# EAGLE design driver_board_v7 (EAGLE 6.5.0)
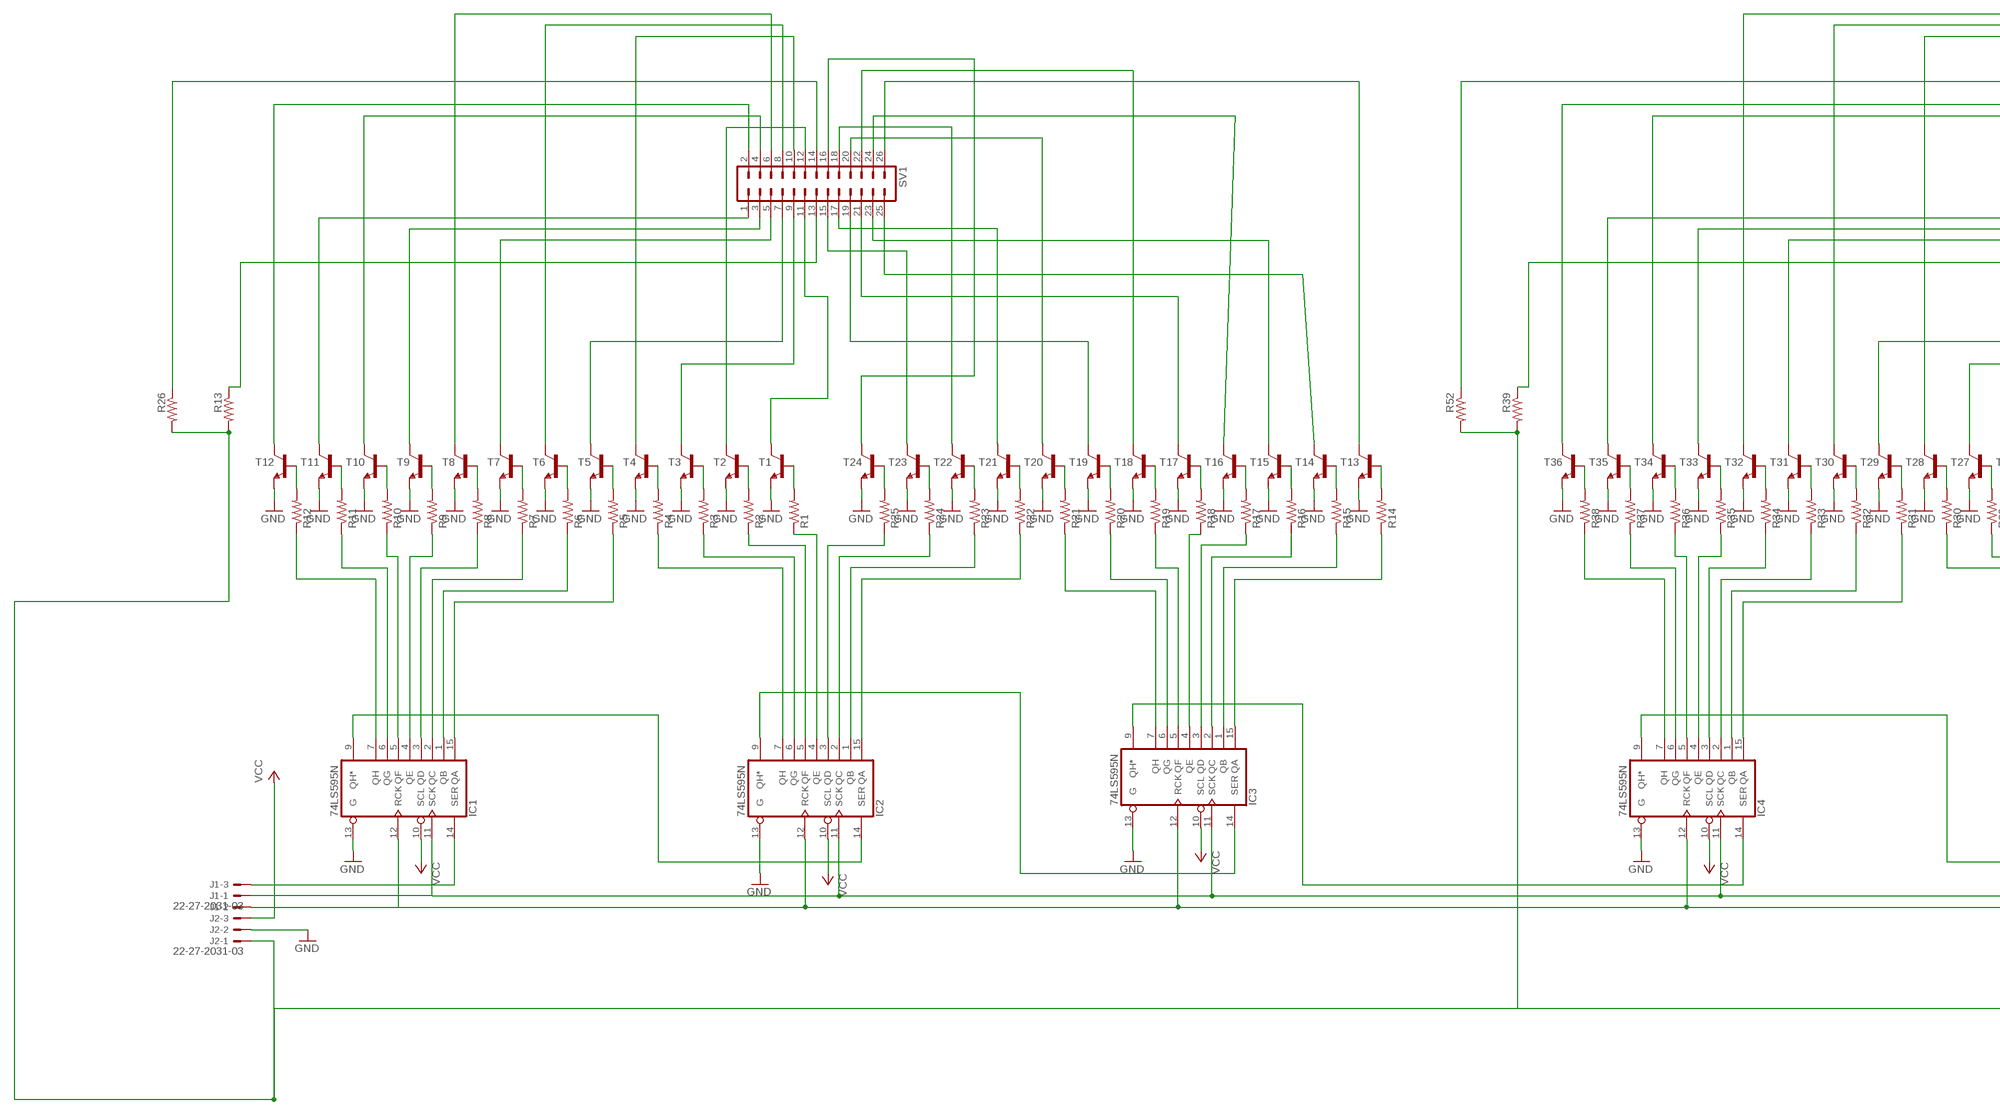
[diagram p0: schematic, sheet 1, part 1 of 2]
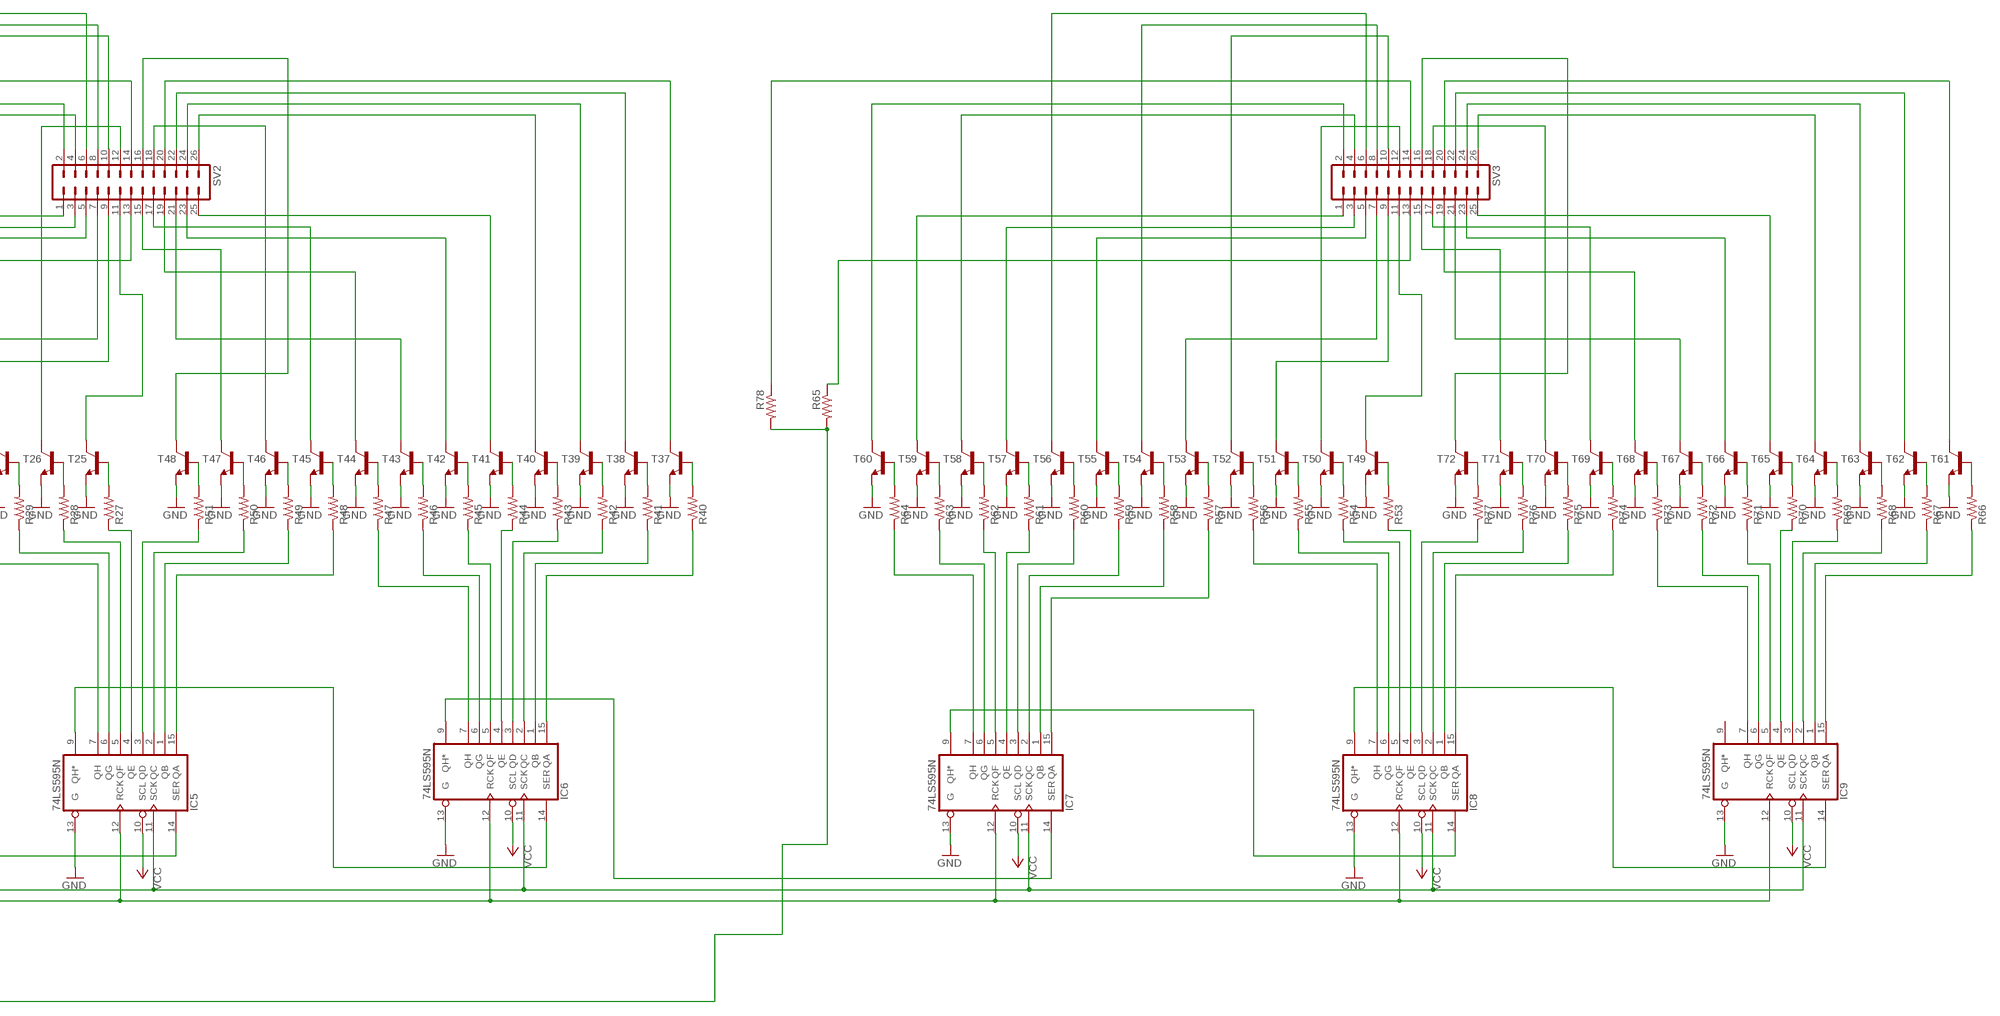
[diagram p1: schematic, sheet 1, part 2 of 2]

## Parts
IC1  74LS595N  [DIL16]
IC2  74LS595N  [DIL16]
IC3  74LS595N  [DIL16]
IC4  74LS595N  [DIL16]
IC5  74LS595N  [DIL16]
IC6  74LS595N  [DIL16]
IC7  74LS595N  [DIL16]
IC8  74LS595N  [DIL16]
IC9  74LS595N  [DIL16]
J1  22-27-2031-03  [6410-03]
J2  22-27-2031-03  [6410-03]
R1  R-US_0204/7  [0204/7]
R2  R-US_0204/7  [0204/7]
R3  R-US_0204/7  [0204/7]
R4  R-US_0204/7  [0204/7]
R5  R-US_0204/7  [0204/7]
R6  R-US_0204/7  [0204/7]
R7  R-US_0204/7  [0204/7]
R8  R-US_0204/7  [0204/7]
R9  R-US_0204/7  [0204/7]
R10  R-US_0204/7  [0204/7]
R11  R-US_0204/7  [0204/7]
R12  R-US_0204/7  [0204/7]
R13  R-US_0204/7  [0204/7]
R14  R-US_0204/7  [0204/7]
R15  R-US_0204/7  [0204/7]
R16  R-US_0204/7  [0204/7]
R17  R-US_0204/7  [0204/7]
R18  R-US_0204/7  [0204/7]
R19  R-US_0204/7  [0204/7]
R20  R-US_0204/7  [0204/7]
R21  R-US_0204/7  [0204/7]
R22  R-US_0204/7  [0204/7]
R23  R-US_0204/7  [0204/7]
R24  R-US_0204/7  [0204/7]
R25  R-US_0204/7  [0204/7]
R26  R-US_0204/7  [0204/7]
R27  R-US_0204/7  [0204/7]
R28  R-US_0204/7  [0204/7]
R29  R-US_0204/7  [0204/7]
R30  R-US_0204/7  [0204/7]
R31  R-US_0204/7  [0204/7]
R32  R-US_0204/7  [0204/7]
R33  R-US_0204/7  [0204/7]
R34  R-US_0204/7  [0204/7]
R35  R-US_0204/7  [0204/7]
R36  R-US_0204/7  [0204/7]
R37  R-US_0204/7  [0204/7]
R38  R-US_0204/7  [0204/7]
R39  R-US_0204/7  [0204/7]
R40  R-US_0204/7  [0204/7]
R41  R-US_0204/7  [0204/7]
R42  R-US_0204/7  [0204/7]
R43  R-US_0204/7  [0204/7]
R44  R-US_0204/7  [0204/7]
R45  R-US_0204/7  [0204/7]
R46  R-US_0204/7  [0204/7]
R47  R-US_0204/7  [0204/7]
R48  R-US_0204/7  [0204/7]
R49  R-US_0204/7  [0204/7]
R50  R-US_0204/7  [0204/7]
R51  R-US_0204/7  [0204/7]
R52  R-US_0204/7  [0204/7]
R53  R-US_0204/7  [0204/7]
R54  R-US_0204/7  [0204/7]
R55  R-US_0204/7  [0204/7]
R56  R-US_0204/7  [0204/7]
R57  R-US_0204/7  [0204/7]
R58  R-US_0204/7  [0204/7]
R59  R-US_0204/7  [0204/7]
R60  R-US_0204/7  [0204/7]
R61  R-US_0204/7  [0204/7]
R62  R-US_0204/7  [0204/7]
R63  R-US_0204/7  [0204/7]
R64  R-US_0204/7  [0204/7]
R65  R-US_0204/7  [0204/7]
R66  R-US_0204/7  [0204/7]
R67  R-US_0204/7  [0204/7]
R68  R-US_0204/7  [0204/7]
R69  R-US_0204/7  [0204/7]
R70  R-US_0204/7  [0204/7]
R71  R-US_0204/7  [0204/7]
R72  R-US_0204/7  [0204/7]
R73  R-US_0204/7  [0204/7]
R74  R-US_0204/7  [0204/7]
R75  R-US_0204/7  [0204/7]
R76  R-US_0204/7  [0204/7]
R77  R-US_0204/7  [0204/7]
R78  R-US_0204/7  [0204/7]
SV1  MA13-2  [MA13-2]
SV2  MA13-2  [MA13-2]
SV3  MA13-2  [MA13-2]
T1  29-NPN-TO92-EBC  [TO92-EBC]
T2  29-NPN-TO92-EBC  [TO92-EBC]
T3  29-NPN-TO92-EBC  [TO92-EBC]
T4  29-NPN-TO92-EBC  [TO92-EBC]
T5  29-NPN-TO92-EBC  [TO92-EBC]
T6  29-NPN-TO92-EBC  [TO92-EBC]
T7  29-NPN-TO92-EBC  [TO92-EBC]
T8  29-NPN-TO92-EBC  [TO92-EBC]
T9  29-NPN-TO92-EBC  [TO92-EBC]
T10  29-NPN-TO92-EBC  [TO92-EBC]
T11  29-NPN-TO92-EBC  [TO92-EBC]
T12  29-NPN-TO92-EBC  [TO92-EBC]
T13  29-NPN-TO92-EBC  [TO92-EBC]
T14  29-NPN-TO92-EBC  [TO92-EBC]
T15  29-NPN-TO92-EBC  [TO92-EBC]
T16  29-NPN-TO92-EBC  [TO92-EBC]
T17  29-NPN-TO92-EBC  [TO92-EBC]
T18  29-NPN-TO92-EBC  [TO92-EBC]
T19  29-NPN-TO92-EBC  [TO92-EBC]
T20  29-NPN-TO92-EBC  [TO92-EBC]
T21  29-NPN-TO92-EBC  [TO92-EBC]
T22  29-NPN-TO92-EBC  [TO92-EBC]
T23  29-NPN-TO92-EBC  [TO92-EBC]
T24  29-NPN-TO92-EBC  [TO92-EBC]
T25  29-NPN-TO92-EBC  [TO92-EBC]
T26  29-NPN-TO92-EBC  [TO92-EBC]
T27  29-NPN-TO92-EBC  [TO92-EBC]
T28  29-NPN-TO92-EBC  [TO92-EBC]
T29  29-NPN-TO92-EBC  [TO92-EBC]
T30  29-NPN-TO92-EBC  [TO92-EBC]
T31  29-NPN-TO92-EBC  [TO92-EBC]
T32  29-NPN-TO92-EBC  [TO92-EBC]
T33  29-NPN-TO92-EBC  [TO92-EBC]
T34  29-NPN-TO92-EBC  [TO92-EBC]
T35  29-NPN-TO92-EBC  [TO92-EBC]
T36  29-NPN-TO92-EBC  [TO92-EBC]
T37  29-NPN-TO92-EBC  [TO92-EBC]
T38  29-NPN-TO92-EBC  [TO92-EBC]
T39  29-NPN-TO92-EBC  [TO92-EBC]
T40  29-NPN-TO92-EBC  [TO92-EBC]
T41  29-NPN-TO92-EBC  [TO92-EBC]
T42  29-NPN-TO92-EBC  [TO92-EBC]
T43  29-NPN-TO92-EBC  [TO92-EBC]
T44  29-NPN-TO92-EBC  [TO92-EBC]
T45  29-NPN-TO92-EBC  [TO92-EBC]
T46  29-NPN-TO92-EBC  [TO92-EBC]
T47  29-NPN-TO92-EBC  [TO92-EBC]
T48  29-NPN-TO92-EBC  [TO92-EBC]
T49  29-NPN-TO92-EBC  [TO92-EBC]
T50  29-NPN-TO92-EBC  [TO92-EBC]
T51  29-NPN-TO92-EBC  [TO92-EBC]
T52  29-NPN-TO92-EBC  [TO92-EBC]
T53  29-NPN-TO92-EBC  [TO92-EBC]
T54  29-NPN-TO92-EBC  [TO92-EBC]
T55  29-NPN-TO92-EBC  [TO92-EBC]
T56  29-NPN-TO92-EBC  [TO92-EBC]
T57  29-NPN-TO92-EBC  [TO92-EBC]
T58  29-NPN-TO92-EBC  [TO92-EBC]
T59  29-NPN-TO92-EBC  [TO92-EBC]
T60  29-NPN-TO92-EBC  [TO92-EBC]
T61  29-NPN-TO92-EBC  [TO92-EBC]
T62  29-NPN-TO92-EBC  [TO92-EBC]
T63  29-NPN-TO92-EBC  [TO92-EBC]
T64  29-NPN-TO92-EBC  [TO92-EBC]
T65  29-NPN-TO92-EBC  [TO92-EBC]
T66  29-NPN-TO92-EBC  [TO92-EBC]
T67  29-NPN-TO92-EBC  [TO92-EBC]
T68  29-NPN-TO92-EBC  [TO92-EBC]
T69  29-NPN-TO92-EBC  [TO92-EBC]
T70  29-NPN-TO92-EBC  [TO92-EBC]
T71  29-NPN-TO92-EBC  [TO92-EBC]
T72  29-NPN-TO92-EBC  [TO92-EBC]

## Nets
GND: IC1.13(G) IC2.13(G) IC3.13(G) IC4.13(G) IC5.13(G) IC6.13(G) IC7.13(G) IC8.13(G) IC9.13(G) J2.2 T1.E T2.E T3.E T4.E T5.E T6.E T7.E T8.E T9.E T10.E T11.E T12.E T13.E T14.E T15.E T16.E T17.E T18.E T19.E T20.E T21.E T22.E T23.E T24.E T25.E T26.E T27.E T28.E T29.E T30.E T31.E T32.E T33.E T34.E T35.E T36.E T37.E T38.E T39.E T40.E T41.E T42.E T43.E T44.E T45.E T46.E T47.E T48.E T49.E T50.E T51.E T52.E T53.E T54.E T55.E T56.E T57.E T58.E T59.E T60.E T61.E T62.E T63.E T64.E T65.E T66.E T67.E T68.E T69.E T70.E T71.E T72.E
HV: J2.1 R13.2 R26.2 R39.2 R52.2 R65.2 R78.2
N$1: R12.2 T12.B
N$2: R11.2 T11.B
N$3: R10.2 T10.B
N$4: R9.2 T9.B
N$5: R8.2 T8.B
N$6: R7.2 T7.B
N$7: R6.2 T6.B
N$8: R5.2 T5.B
N$9: R4.2 T4.B
N$10: R3.2 T3.B
N$11: R2.2 T2.B
N$12: R1.2 T1.B
N$13: SV1.11 T1.C
N$14: R38.2 T36.B
N$15: R37.2 T35.B
N$16: SV1.3 T9.C
N$17: SV1.6 T8.C
N$18: SV1.5 T7.C
N$19: R36.2 T34.B
N$20: SV1.12 T2.C
N$21: SV1.9 T3.C
N$22: SV1.8 T6.C
N$23: SV1.7 T5.C
N$24: SV1.10 T4.C
N$25: R26.1 SV1.14
N$26: R25.2 T24.B
N$27: R24.2 T23.B
N$28: R23.2 T22.B
N$29: R22.2 T21.B
N$30: R21.2 T20.B
N$31: R20.2 T19.B
N$32: R19.2 T18.B
N$33: R18.2 T17.B
N$34: R17.2 T16.B
N$35: R16.2 T15.B
N$36: R15.2 T14.B
N$37: R14.2 T13.B
N$38: SV1.16 T24.C
N$39: SV1.15 T23.C
N$40: SV1.18 T22.C
N$41: SV1.17 T21.C
N$42: SV1.20 T20.C
N$43: SV1.19 T19.C
N$44: SV1.26 T13.C
N$45: SV1.25 T14.C
N$46: SV1.23 T15.C
N$47: SV1.22 T18.C
N$48: SV1.21 T17.C
N$49: SV1.24 T16.C
N$51: R13.1 SV1.13
N$52: IC1.9(QH*) IC2.14(SER)
N$53: IC2.9(QH*) IC3.14(SER)
N$54: IC3.9(QH*) IC4.14(SER)
N$56: R35.2 T33.B
N$57: SV1.2 T12.C
N$60: SV1.1 T11.C
N$61: SV1.4 T10.C
N$62: R34.2 T32.B
N$63: R33.2 T31.B
N$64: R32.2 T30.B
N$65: R31.2 T29.B
N$66: R30.2 T28.B
N$67: R29.2 T27.B
N$68: R28.2 T26.B
N$69: R27.2 T25.B
N$70: SV2.3 T33.C
N$71: SV2.6 T32.C
N$72: SV2.5 T31.C
N$73: SV2.12 T26.C
N$74: SV2.9 T27.C
N$75: IC1.7(QH) R12.1
N$76: IC1.6(QG) R11.1
N$77: IC1.5(QF) R10.1
N$78: IC1.4(QE) R9.1
N$79: IC1.3(QD) R8.1
N$80: IC1.2(QC) R7.1
N$81: IC1.1(QB) R6.1
N$82: IC1.15(QA) R5.1
N$83: SV2.8 T30.C
N$84: IC2.7(QH) R4.1
N$85: IC2.6(QG) R3.1
N$86: IC2.5(QF) R2.1
N$87: IC2.4(QE) R1.1
N$88: IC2.3(QD) R25.1
N$89: IC2.2(QC) R24.1
N$90: IC2.1(QB) R23.1
N$91: IC2.15(QA) R22.1
N$92: IC3.7(QH) R21.1
N$93: IC3.6(QG) R20.1
N$94: IC3.5(QF) R19.1
N$95: IC3.4(QE) R18.1
N$96: IC3.3(QD) R17.1
N$97: IC3.2(QC) R16.1
N$98: IC3.1(QB) R15.1
N$99: IC3.15(QA) R14.1
N$100: SV2.7 T29.C
N$101: SV2.10 T28.C
N$102: R51.2 T48.B
N$103: R50.2 T47.B
N$104: R49.2 T46.B
N$105: R48.2 T45.B
N$106: R47.2 T44.B
N$107: R46.2 T43.B
N$108: R45.2 T42.B
N$109: R44.2 T41.B
N$110: R43.2 T40.B
N$111: R42.2 T39.B
N$112: R41.2 T38.B
N$113: R40.2 T37.B
N$114: SV2.16 T48.C
N$115: SV2.15 T47.C
N$116: SV2.18 T46.C
N$117: SV2.17 T45.C
N$118: SV2.19 T44.C
N$119: SV2.21 T43.C
N$120: SV2.20 T37.C
N$121: SV2.22 T38.C
N$122: SV2.24 T39.C
N$123: SV2.23 T42.C
N$124: SV2.25 T41.C
N$125: SV2.26 T40.C
N$126: IC4.7(QH) R38.1
N$127: IC4.6(QG) R37.1
N$128: IC4.5(QF) R36.1
N$129: IC4.4(QE) R35.1
N$130: IC4.3(QD) R34.1
N$131: IC4.2(QC) R33.1
N$132: IC4.1(QB) R32.1
N$133: IC4.15(QA) R31.1
N$134: IC5.7(QH) R30.1
N$135: IC5.6(QG) R29.1
N$136: IC5.5(QF) R28.1
N$137: IC5.4(QE) R27.1
N$138: IC5.3(QD) R51.1
N$139: IC5.2(QC) R50.1
N$140: IC5.1(QB) R49.1
N$141: IC5.15(QA) R48.1
N$142: IC6.7(QH) R47.1
N$143: IC6.6(QG) R46.1
N$144: IC6.5(QF) R45.1
N$145: IC6.4(QE) R44.1
N$146: IC6.3(QD) R43.1
N$147: IC6.2(QC) R42.1
N$148: IC6.1(QB) R41.1
N$149: IC6.15(QA) R40.1
N$151: IC4.9(QH*) IC5.14(SER)
N$152: IC5.9(QH*) IC6.14(SER)
N$153: IC6.9(QH*) IC7.14(SER)
N$157: SV2.11 T25.C
N$158: R52.1 SV2.14
N$159: R39.1 SV2.13
N$160: SV2.2 T36.C
N$161: SV2.1 T35.C
N$162: SV2.4 T34.C
N$163: R64.2 T60.B
N$164: R63.2 T59.B
N$165: R62.2 T58.B
N$166: R61.2 T57.B
N$167: R60.2 T56.B
N$168: R59.2 T55.B
N$169: R58.2 T54.B
N$170: R57.2 T53.B
N$171: R56.2 T52.B
N$172: R55.2 T51.B
N$173: R54.2 T50.B
N$174: R53.2 T49.B
N$175: SV3.3 T57.C
N$176: SV3.6 T56.C
N$177: SV3.5 T55.C
N$178: SV3.12 T50.C
N$179: SV3.9 T51.C
N$180: SV3.8 T54.C
N$181: SV3.7 T53.C
N$182: SV3.10 T52.C
N$183: R77.2 T72.B
N$184: R76.2 T71.B
N$185: R75.2 T70.B
N$186: R74.2 T69.B
N$187: R73.2 T68.B
N$188: R72.2 T67.B
N$189: R71.2 T66.B
N$190: R70.2 T65.B
N$191: R69.2 T64.B
N$192: R68.2 T63.B
N$193: R67.2 T62.B
N$194: R66.2 T61.B
N$195: SV3.16 T72.C
N$196: SV3.15 T71.C
N$197: SV3.18 T70.C
N$198: SV3.17 T69.C
N$199: SV3.19 T68.C
N$200: SV3.21 T67.C
N$201: SV3.20 T61.C
N$202: SV3.22 T62.C
N$203: SV3.24 T63.C
N$204: SV3.23 T66.C
N$205: SV3.25 T65.C
N$206: SV3.26 T64.C
N$207: IC7.7(QH) R64.1
N$208: IC7.6(QG) R63.1
N$209: IC7.5(QF) R62.1
N$210: IC7.4(QE) R61.1
N$211: IC7.3(QD) R60.1
N$212: IC7.2(QC) R59.1
N$213: IC7.1(QB) R58.1
N$214: IC7.15(QA) R57.1
N$215: IC8.7(QH) R56.1
N$216: IC8.6(QG) R55.1
N$217: IC8.5(QF) R54.1
N$218: IC8.4(QE) R53.1
N$219: IC8.3(QD) R77.1
N$220: IC8.2(QC) R76.1
N$221: IC8.1(QB) R75.1
N$222: IC8.15(QA) R74.1
N$223: IC9.7(QH) R73.1
N$224: IC9.6(QG) R72.1
N$225: IC9.5(QF) R71.1
N$226: IC9.4(QE) R70.1
N$227: IC9.3(QD) R69.1
N$228: IC9.2(QC) R68.1
N$229: IC9.1(QB) R67.1
N$230: IC9.15(QA) R66.1
N$232: IC7.9(QH*) IC8.14(SER)
N$233: IC8.9(QH*) IC9.14(SER)
N$238: SV3.11 T49.C
N$239: R78.1 SV3.14
N$240: R65.1 SV3.13
N$241: SV3.2 T60.C
N$242: SV3.1 T59.C
N$243: SV3.4 T58.C
RCK: IC1.12(RCK) IC2.12(RCK) IC3.12(RCK) IC4.12(RCK) IC5.12(RCK) IC6.12(RCK) IC7.12(RCK) IC8.12(RCK) IC9.12(RCK) J1.2
SCK: IC1.11(SCK) IC2.11(SCK) IC3.11(SCK) IC4.11(SCK) IC5.11(SCK) IC6.11(SCK) IC7.11(SCK) IC8.11(SCK) IC9.11(SCK) J1.1
SER: IC1.14(SER) J1.3
VCC: IC1.10(SCL) IC2.10(SCL) IC3.10(SCL) IC4.10(SCL) IC5.10(SCL) IC6.10(SCL) IC7.10(SCL) IC8.10(SCL) IC9.10(SCL) J2.3
Unconnected: IC9.9(QH*)

## Power pins joined to a net without a drawn wire
GND: IC1.8(GND) IC2.8(GND) IC3.8(GND) IC4.8(GND) IC5.8(GND) IC6.8(GND) IC7.8(GND) IC8.8(GND) IC9.8(GND)
VCC: IC1.16(VCC) IC2.16(VCC) IC3.16(VCC) IC4.16(VCC) IC5.16(VCC) IC6.16(VCC) IC7.16(VCC) IC8.16(VCC) IC9.16(VCC)

## Library data of the parts
IC1-IC9 = 74xx-us:74*595: 8-bit SHIFT REGISTER, output latch
J1 J2 = con-molex:22-?-03: CONNECTOR wire to board 2.54 mm (.1 inch) pitch header; OC_FARNELL: unknown; OC_NEWARK: unknown
R1-R78 = resistor:R-US_: RESISTOR, American symbol
SV1-SV3 = con-lstb:MA13-2: PIN HEADER; OC_FARNELL: unknown; OC_NEWARK: unknown
T1-T72 = transistor:*-NPN-: NPN Transistror BF959 corrected 2008.03.06

## Board
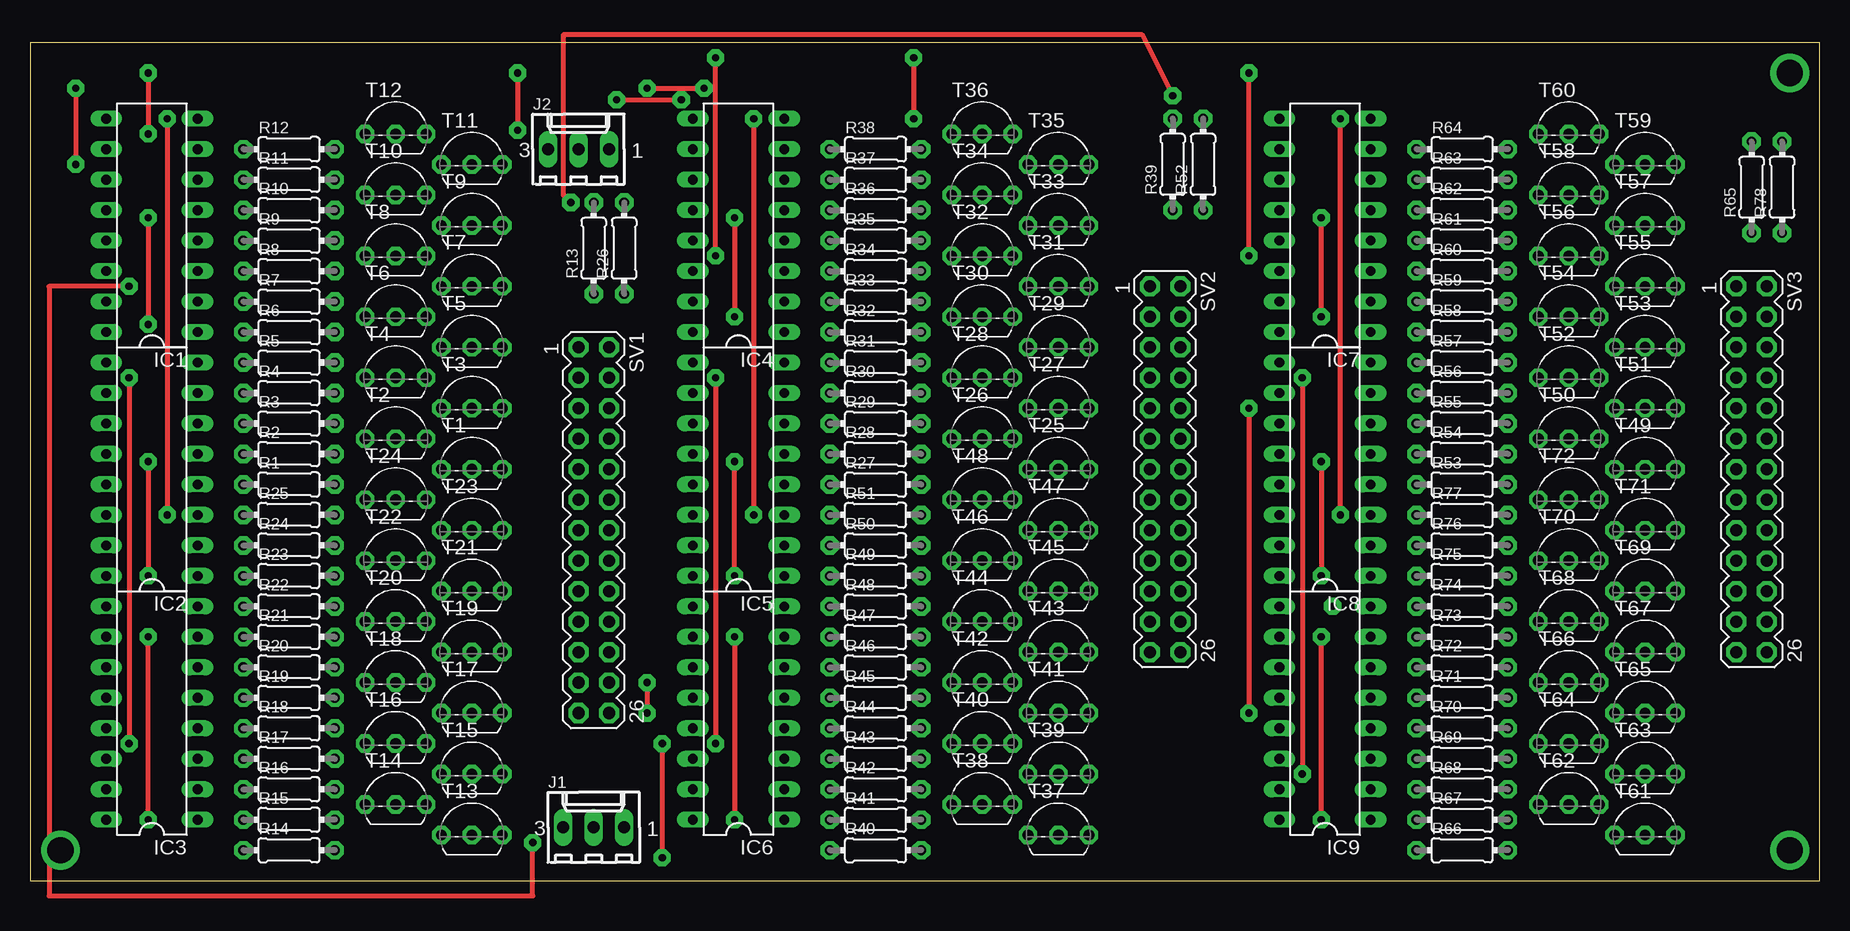
[diagram p2: board, top side]
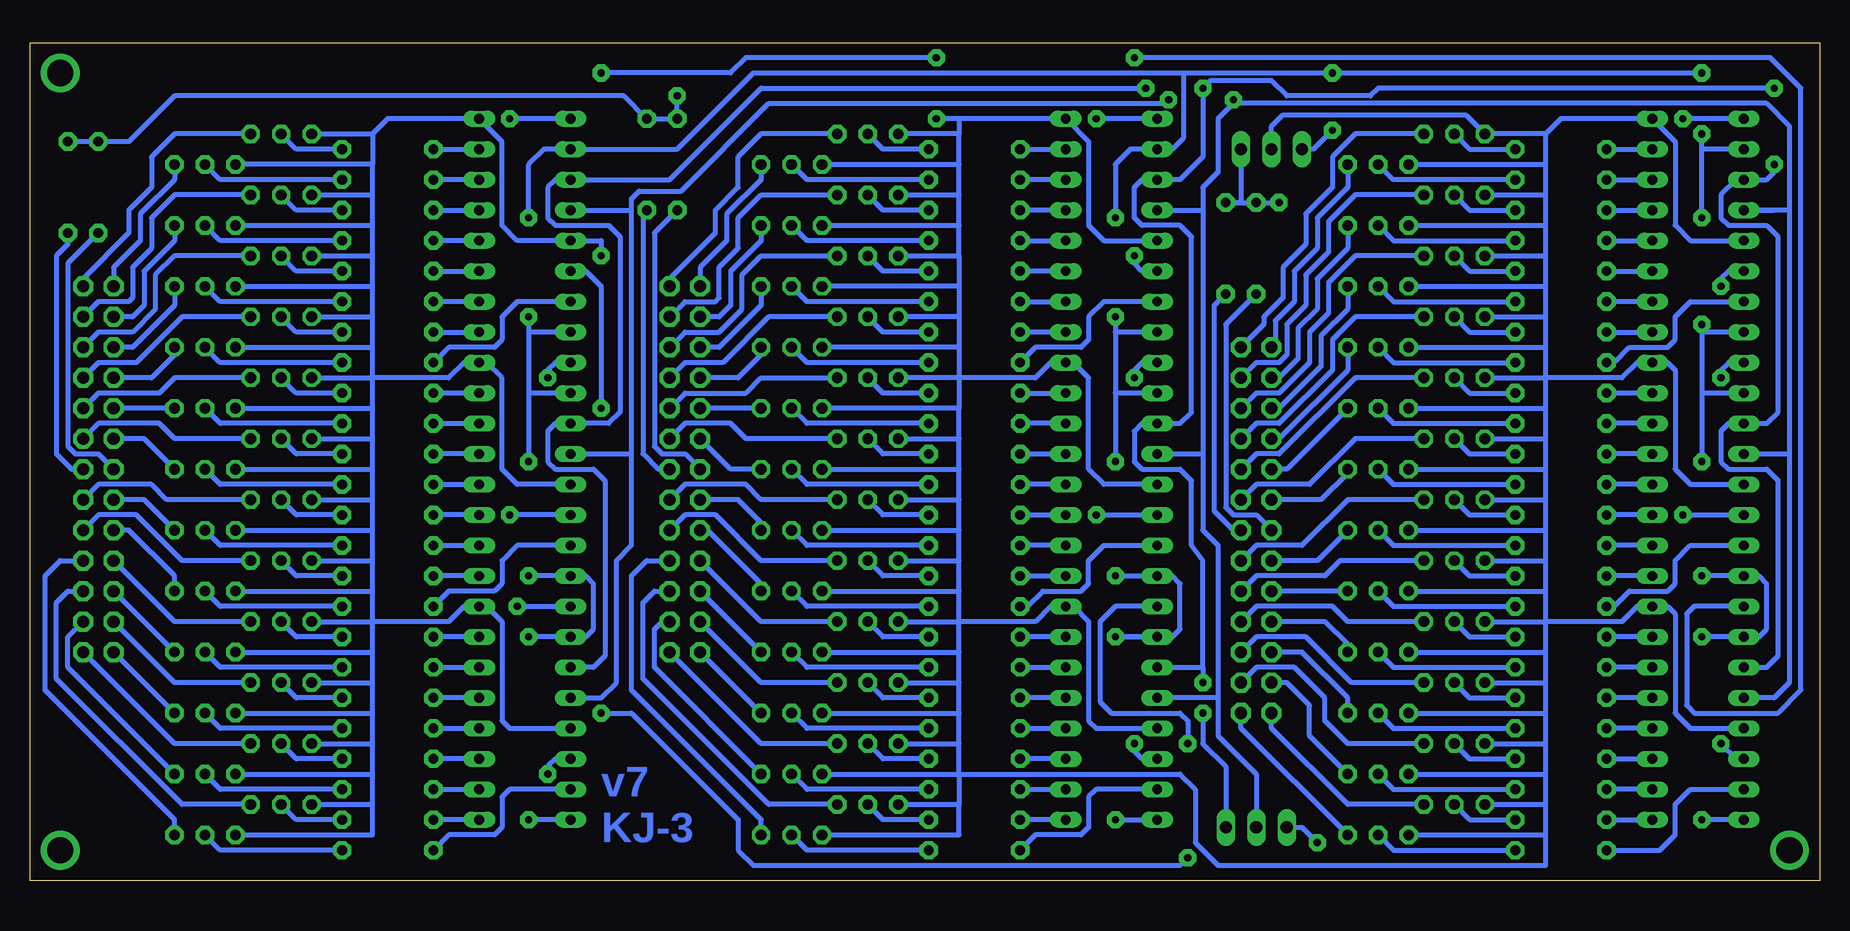
[diagram p3: board, bottom side, seen from below]

Size 149.21 x 69.84 mm. Coordinates in mm from the lower left corner, seen from the top.
Outline: 0,0 149.21,0 149.21,69.84 0,69.84 0,0
Copper layers (1*16): Top 0.035mm / dielectric 1.5mm / Bottom 0.035mm
Design rules "default": minimum track width 10mil, minimum drill 24mil, track to track 8mil, track to pad 8mil, pad to pad 8mil, via to via 8mil, smd to smd 8mil, copper to edge 40mil, drill to drill 8mil, minimum pad ring 10mil, minimum via ring 8mil, stop-mask expansion 4mil, vias tented up to drill 0mil, thermal gap 10mil

### Footprints (pad centres in the part's own frame; a part is rotated, then mirrored left to right if it is on the bottom)
DIL16 = drill 0.813 long: 1 -8.89,-3.81; 2 -6.35,-3.81; 3 -3.81,-3.81; 4 -1.27,-3.81; 5 1.27,-3.81; 6 3.81,-3.81; 7 6.35,-3.81; 8 8.89,-3.81; 9 8.89,3.81; 10 6.35,3.81; 11 3.81,3.81; 12 1.27,3.81; 13 -1.27,3.81; 14 -3.81,3.81; 15 -6.35,3.81; 16 -8.89,3.81
6410-03 = drill 1.016 long: 1 2.54,0; 2 0,0; 3 -2.54,0
0204/7 = drill 0.813 pad 1.524 octagon: 1 -3.81,0; 2 3.81,0
MA13-2 = drill 1.016 pad 1.676 octagon: 1 -15.24,-1.27; 2 -15.24,1.27; 3 -12.7,-1.27; 4 -12.7,1.27; 5 -10.16,-1.27; 6 -10.16,1.27; 7 -7.62,-1.27; 8 -7.62,1.27; 9 -5.08,-1.27; 10 -5.08,1.27; 11 -2.54,-1.27; 12 -2.54,1.27; 13 0,-1.27; 14 0,1.27; 15 2.54,-1.27; 16 2.54,1.27; 17 5.08,-1.27; 18 5.08,1.27; 19 7.62,-1.27; 20 7.62,1.27; 21 10.16,-1.27; 22 10.16,1.27; 23 12.7,-1.27; 24 12.7,1.27; 25 15.24,-1.27; 26 15.24,1.27
TO92-EBC = drill 0.889 pad 1.524 octagon: B 0,-1.27; C 2.54,-1.27; E -2.54,-1.27

### Placement (x,y rotation side)
IC1  10.16,54.61 90 top
IC2  10.16,34.29 90 top
IC3  10.16,13.97 90 top
IC4  59.05,54.61 90 top
IC5  59.05,34.29 90 top
IC6  59.05,13.97 90 top
IC7  107.95,54.61 90 top
IC8  107.95,34.29 90 top
IC9  107.95,13.97 90 top
J1  46.99,4.45 0 top
J2  45.72,60.96 0 top
R1  21.59,33.02 0 top
R2  21.59,35.56 0 top
R3  21.59,38.1 0 top
R4  21.59,40.64 0 top
R5  21.59,43.18 0 top
R6  21.59,45.72 0 top
R7  21.59,48.26 0 top
R8  21.59,50.8 0 top
R9  21.59,53.34 0 top
R10  21.59,55.88 0 top
R11  21.59,58.42 0 top
R12  21.59,60.96 0 top
R13  46.99,52.7 90 top
R14  21.59,2.54 0 top
R15  21.59,5.08 0 top
R16  21.59,7.62 0 top
R17  21.59,10.16 0 top
R18  21.59,12.7 0 top
R19  21.59,15.24 0 top
R20  21.59,17.78 0 top
R21  21.59,20.32 0 top
R22  21.59,22.86 0 top
R23  21.59,25.4 0 top
R24  21.59,27.94 0 top
R25  21.59,30.48 0 top
R26  49.53,52.7 90 top
R27  70.48,33.02 0 top
R28  70.48,35.56 0 top
R29  70.48,38.1 0 top
R30  70.48,40.64 0 top
R31  70.48,43.18 0 top
R32  70.48,45.72 0 top
R33  70.48,48.26 0 top
R34  70.48,50.8 0 top
R35  70.48,53.34 0 top
R36  70.48,55.88 0 top
R37  70.48,58.42 0 top
R38  70.48,60.96 0 top
R39  95.25,59.69 90 top
R40  70.48,2.54 0 top
R41  70.48,5.08 0 top
R42  70.48,7.62 0 top
R43  70.48,10.16 0 top
R44  70.48,12.7 0 top
R45  70.48,15.24 0 top
R46  70.48,17.78 0 top
R47  70.48,20.32 0 top
R48  70.48,22.86 0 top
R49  70.48,25.4 0 top
R50  70.48,27.94 0 top
R51  70.48,30.48 0 top
R52  97.79,59.69 90 top
R53  119.38,33.02 0 top
R54  119.38,35.56 0 top
R55  119.38,38.1 0 top
R56  119.38,40.64 0 top
R57  119.38,43.18 0 top
R58  119.38,45.72 0 top
R59  119.38,48.26 0 top
R60  119.38,50.8 0 top
R61  119.38,53.34 0 top
R62  119.38,55.88 0 top
R63  119.38,58.42 0 top
R64  119.38,60.96 0 top
R65  143.51,57.78 90 top
R66  119.38,2.54 0 top
R67  119.38,5.08 0 top
R68  119.38,7.62 0 top
R69  119.38,10.16 0 top
R70  119.38,12.7 0 top
R71  119.38,15.24 0 top
R72  119.38,17.78 0 top
R73  119.38,20.32 0 top
R74  119.38,22.86 0 top
R75  119.38,25.4 0 top
R76  119.38,27.94 0 top
R77  119.38,30.48 0 top
R78  146.05,57.78 90 top
SV1  46.99,29.21 270 top
SV2  94.61,34.29 270 top
SV3  143.51,34.29 270 top
T1  36.83,35.56 0 top
T2  30.48,38.1 0 top
T3  36.83,40.64 0 top
T4  30.48,43.18 0 top
T5  36.83,45.72 0 top
T6  30.48,48.26 0 top
T7  36.83,50.8 0 top
T8  30.48,53.34 0 top
T9  36.83,55.88 0 top
T10  30.48,58.42 0 top
T11  36.83,60.96 0 top
T12  30.48,63.5 0 top
T13  36.83,5.08 0 top
T14  30.48,7.62 0 top
T15  36.83,10.16 0 top
T16  30.48,12.7 0 top
T17  36.83,15.24 0 top
T18  30.48,17.78 0 top
T19  36.83,20.32 0 top
T20  30.48,22.86 0 top
T21  36.83,25.4 0 top
T22  30.48,27.94 0 top
T23  36.83,30.48 0 top
T24  30.48,33.02 0 top
T25  85.72,35.56 0 top
T26  79.38,38.1 0 top
T27  85.72,40.64 0 top
T28  79.38,43.18 0 top
T29  85.72,45.72 0 top
T30  79.38,48.26 0 top
T31  85.72,50.8 0 top
T32  79.38,53.34 0 top
T33  85.72,55.88 0 top
T34  79.38,58.42 0 top
T35  85.72,60.96 0 top
T36  79.38,63.5 0 top
T37  85.72,5.08 0 top
T38  79.38,7.62 0 top
T39  85.72,10.16 0 top
T40  79.38,12.7 0 top
T41  85.72,15.24 0 top
T42  79.38,17.78 0 top
T43  85.72,20.32 0 top
T44  79.38,22.86 0 top
T45  85.72,25.4 0 top
T46  79.38,27.94 0 top
T47  85.72,30.48 0 top
T48  79.38,33.02 0 top
T49  134.62,35.56 0 top
T50  128.27,38.1 0 top
T51  134.62,40.64 0 top
T52  128.27,43.18 0 top
T53  134.62,45.72 0 top
T54  128.27,48.26 0 top
T55  134.62,50.8 0 top
T56  128.27,53.34 0 top
T57  134.62,55.88 0 top
T58  128.27,58.42 0 top
T59  134.62,60.96 0 top
T60  128.27,63.5 0 top
T61  134.62,5.08 0 top
T62  128.27,7.62 0 top
T63  134.62,10.16 0 top
T64  128.27,12.7 0 top
T65  134.62,15.24 0 top
T66  128.27,17.78 0 top
T67  134.62,20.32 0 top
T68  128.27,22.86 0 top
T69  134.62,25.4 0 top
T70  128.27,27.94 0 top
T71  134.62,30.48 0 top
T72  128.27,33.02 0 top

### Tracks (layer width: path | path; a pad name or v marks a point on that pad's centre or on a via)
GND  (via drill 0.6 pad 1.42)
  Top 0.406: v73.66,68.58 v73.66,63.5 | v101.6,52.07 v101.6,67.31
  Bottom 0.406: 22.86,41.91 16.51,41.91 15.24,43.18 IC2.8 12.7,43.18 12.06,42.55 12.06,34.29 10.79,33.02 IC2.13 | T13.E 22.86,3.81 | 22.86,3.81 22.86,6.35 | 22.86,6.35 22.86,8.89 | 22.86,8.89 22.86,11.43 | 22.86,11.43 22.86,13.97 | 22.86,13.97 22.86,16.51 | 22.86,16.51 22.86,19.05 | 22.86,19.05 22.86,21.59 | 22.86,21.59 22.86,24.13 | 22.86,24.13 22.86,26.67 | 22.86,26.67 22.86,29.21 | 22.86,29.21 22.86,31.75 | 22.86,31.75 22.86,34.29 | 22.86,34.29 22.86,36.83 | 22.86,36.83 22.86,39.37 | 22.86,39.37 22.86,41.91 | T4.E 22.86,41.91 | 22.86,41.91 22.86,44.45 | 22.86,44.45 22.86,46.99 | 22.86,46.99 22.86,49.53 | 22.86,49.53 22.86,52.07 | 22.86,52.07 22.86,54.61 | 22.86,54.61 22.86,57.15 | 22.86,57.15 22.86,59.69 | 22.86,59.69 22.86,62.23 | 22.86,62.23 T12.E 29.53,63.82 44.77,63.82 45.72,62.87 J2.2 | T10.E 22.86,57.15 | T8.E 22.86,52.07 | T6.E 22.86,46.99 | T11.E 22.86,59.69 | T9.E 22.86,54.61 | T7.E 22.86,49.53 | T5.E 22.86,44.45 | T3.E 22.86,39.37 | T2.E 22.86,36.83 | T1.E 22.86,34.29 | T23.E 22.86,29.21 | T24.E 22.86,31.75 | T21.E 22.86,24.13 | T19.E 22.86,19.05 | T20.E 22.86,21.59 | T17.E 22.86,13.97 | T18.E 22.86,16.51 | T16.E 22.86,11.43 | T15.E 22.86,8.89 | T14.E 22.86,6.35 | 22.86,62.23 21.59,63.5 IC1.8 12.06,61.59 12.06,54.61 10.79,53.34 IC1.13 | IC3.13 10.79,12.7 12.06,13.97 12.06,22.23 12.7,22.86 IC3.8 15.24,22.86 16.51,21.59 22.86,21.59 | T22.E 22.86,26.67 | 71.75,8.89 53.34,8.89 52.07,7.62 52.07,3.17 50.16,1.27 22.86,1.27 22.86,3.81 | 71.75,63.5 IC4.8 60.96,61.59 60.96,54.61 59.69,53.34 IC4.13 | 71.75,63.5 71.75,62.23 | 71.75,62.23 T36.E | T35.E 71.75,59.69 | 71.75,59.69 71.75,62.23 | T33.E 71.75,54.61 | 71.75,54.61 71.75,57.15 | 71.75,57.15 71.75,59.69 | T34.E 71.75,57.15
  Bottom 0.406: T32.E 71.75,52.07 | 71.75,52.07 71.75,54.61 | 71.75,52.07 71.75,49.53 | 71.75,49.53 T31.E | 71.75,49.53 71.75,46.99 | 71.75,46.99 T30.E | 71.75,46.99 71.75,44.45 | 71.75,44.45 T29.E | 71.75,44.45 71.75,41.91 | 71.75,41.91 T28.E | 71.75,41.91 71.75,39.37 | 71.75,39.37 T27.E | T25.E 71.75,34.29 | 71.75,34.29 71.75,36.83 | 71.75,36.83 71.75,39.37 | T26.E 71.75,36.83 | T47.E 71.75,29.21 | 71.75,29.21 71.75,31.75 | 71.75,31.75 71.75,34.29 | T48.E 71.75,31.75 | T46.E 71.75,26.67 | 71.75,26.67 71.75,29.21 | T45.E 71.75,24.13 | 71.75,24.13 71.75,26.67 | T43.E 71.75,19.05 | 71.75,19.05 71.75,21.59 | 71.75,21.59 71.75,24.13 | T44.E 71.75,21.59 | T42.E 71.75,16.51 | 71.75,16.51 71.75,19.05 | T41.E 71.75,13.97 | 71.75,13.97 71.75,16.51 | T40.E 71.75,11.43 | 71.75,11.43 71.75,13.97 | T39.E 71.75,8.89 | 71.75,8.89 71.75,11.43 | T38.E 71.75,6.35 | T37.E 71.75,3.81 71.75,6.35 | 71.75,41.91 65.41,41.91 64.14,43.18 IC5.8 62.23,43.18 60.96,41.91 60.96,34.29 59.69,33.02 IC5.13 | 71.75,21.59 65.41,21.59 64.14,22.86 IC6.8 62.23,22.86 60.96,21.59 60.96,13.34 60.33,12.7 IC6.13 | 71.75,8.89 71.75,6.35 | T60.E 120.65,62.23 | 120.65,62.23 120.65,59.69 | 120.65,59.69 T59.E | 120.65,62.23 119.38,63.5 IC7.8 109.86,61.59 109.86,54.61 108.58,53.34 IC7.13 101.6,53.34 v101.6,52.07 | T58.E 120.65,57.15 | 120.65,57.15 120.65,59.69 | T57.E 120.65,54.61 | 120.65,54.61 120.65,57.15 | T56.E 120.65,52.07 | 120.65,52.07 120.65,54.61 | T55.E 120.65,49.53 | 120.65,49.53 120.65,52.07 | T54.E 120.65,46.99 | 120.65,46.99 120.65,49.53 | T53.E 120.65,44.45 | 120.65,44.45 120.65,46.99 | T52.E 120.65,41.91 | 120.65,41.91 120.65,44.45 | T51.E 120.65,39.37 | 120.65,39.37 120.65,41.91 | T50.E 120.65,36.83 | 120.65,36.83 120.65,39.37
  Bottom 0.406: T49.E 120.65,34.29 | 120.65,34.29 120.65,36.83 | T72.E 120.65,31.75 | 120.65,31.75 120.65,34.29 | T71.E 120.65,29.21 | 120.65,29.21 120.65,31.75 | T70.E 120.65,26.67 | 120.65,26.67 120.65,29.21 | T69.E 120.65,24.13 | 120.65,24.13 120.65,26.67 | T68.E 120.65,21.59 | 120.65,21.59 120.65,24.13 | T67.E 120.65,19.05 | 120.65,19.05 120.65,21.59 | T66.E 120.65,16.51 | 120.65,16.51 120.65,19.05 | T65.E 120.65,13.97 | 120.65,13.97 120.65,16.51 | T64.E 120.65,11.43 | 120.65,11.43 120.65,13.97 | T63.E 120.65,8.89 | 120.65,8.89 120.65,11.43 | T62.E 120.65,6.35 | 120.65,6.35 120.65,8.89 | T61.E 120.65,3.81 120.65,6.35 | 120.65,41.91 114.3,41.91 113.03,43.18 IC8.8 111.12,43.18 109.86,41.91 109.86,34.29 108.58,33.02 IC8.13 | 120.65,21.59 114.3,21.59 113.03,22.86 IC9.8 111.12,22.86 109.86,21.59 109.86,13.34 109.22,12.7 IC9.13 | 71.75,63.5 v73.66,63.5 | v73.66,68.58 89.53,68.58 90.81,67.31 v101.6,67.31
HV  (via drill 0.6 pad 1.42)
  Top 0.406: v95.25,65.41 92.71,70.48 44.45,70.48 44.45,57.15 v45.09,56.52
  Bottom 0.406: J2.1 48.26,56.52 | 48.26,56.52 R13.2 | 48.26,56.52 R26.2 v45.09,56.52 | v95.25,65.41 R39.2 R52.2 99.69,65.41 137.16,65.41 140.97,61.59 R65.2 R78.2
N$1
  Bottom 0.406: T12.B 29.21,60.96 R12.2
N$2
  Bottom 0.406: R11.2 35.56,58.42 T11.B
N$3
  Bottom 0.406: T10.B 29.21,55.88 R10.2
N$4
  Bottom 0.406: T9.B 35.56,53.34 R9.2
N$5
  Bottom 0.406: T8.B 29.21,50.8 R8.2
N$6
  Bottom 0.406: T7.B 35.56,48.26 R7.2
N$7
  Bottom 0.406: T6.B 29.21,45.72 R6.2
N$8
  Bottom 0.406: T5.B 35.56,43.18 R5.2
N$9
  Bottom 0.406: T4.B 29.21,40.64 R4.2
N$10
  Bottom 0.406: T3.B 35.56,38.1 R3.2
N$11
  Bottom 0.406: T2.B 29.21,35.56 R2.2
N$12
  Bottom 0.406: T1.B 35.56,33.02 R1.2
N$13
  Bottom 0.406: T1.C 39.37,33.97 41.59,31.75 SV1.11
N$14
  Bottom 0.406: R38.2 78.11,60.96 T36.B
N$15
  Bottom 0.406: R37.2 84.45,58.42 T35.B
N$16
  Bottom 0.406: T9.C 39.37,52.7 41.91,50.16 41.91,47.62 43.5,46.04 43.5,43.5 45.09,41.91 SV1.3
N$17
  Bottom 0.406: T8.C 38.73,52.07 40.96,49.85 40.96,47.31 42.55,45.72 42.55,43.18 45.09,40.64 46.99,40.64 SV1.6
N$18
  Bottom 0.406: T7.C 39.37,47.62 41.59,45.4 41.59,42.86 45.09,39.37 SV1.5
N$19
  Bottom 0.406: R36.2 78.11,55.88 T34.B
N$20
  Bottom 0.406: T2.C 38.73,36.83 42.55,33.02 46.99,33.02 SV1.12
N$21
  Bottom 0.406: T3.C 44.45,34.29 SV1.9
N$22
  Bottom 0.406: T6.C 38.73,46.99 40.64,45.09 40.64,42.55 45.09,38.1 46.99,38.1 SV1.8
N$23
  Bottom 0.406: T5.C 39.37,42.55 45.09,36.83 SV1.7 45.4,36.83
N$24
  Bottom 0.406: T4.C 38.73,41.91 45.09,35.56 46.99,35.56 SV1.10
N$25
  Bottom 0.406: SV1.14 48.9,29.21 50.48,30.8 50.48,47.94 R26.1
N$26
  Bottom 0.406: T24.B 29.21,30.48 R25.2
N$27
  Bottom 0.406: T23.B 35.56,27.94 R24.2
N$28
  Bottom 0.406: T22.B 29.21,25.4 R23.2
N$29
  Bottom 0.406: T21.B 35.56,22.86 R22.2
N$30
  Bottom 0.406: T20.B 29.21,20.32 R21.2
N$31
  Bottom 0.406: T19.B 35.56,17.78 R20.2
N$32
  Bottom 0.406: T18.B 29.21,15.24 R19.2
N$33
  Bottom 0.406: T17.B 35.56,12.7 R18.2
N$34
  Bottom 0.406: T16.B 29.21,10.16 R17.2
N$35
  Bottom 0.406: T15.B 35.56,7.62 R16.2
N$36
  Bottom 0.406: T14.B 29.21,5.08 R15.2
N$37
  Bottom 0.406: T13.B 35.56,2.54 R14.2
N$38
  Bottom 0.406: T24.C 39.37,31.75 43.18,27.94 46.99,27.94 SV1.16
N$39
  Bottom 0.406: T23.C 41.91,26.67 SV1.15
N$40
  Bottom 0.406: T22.C 40.01,26.67 41.27,25.4 46.99,25.4 SV1.18
N$41
  Bottom 0.406: T21.C SV1.17
N$42
  Bottom 0.406: T20.C 39.37,21.59 40.64,22.86 46.99,22.86 SV1.20
N$43
  Bottom 0.406: T19.C 39.37,19.68 41.27,21.59 SV1.19
N$44
  Bottom 0.406: T13.C 48.26,12.7 SV1.26
N$45
  Bottom 0.406: T14.C 39.37,6.35 45.72,12.7 SV1.25
N$46
  Bottom 0.406: T15.C 42.55,12.06 42.55,14.61 44.45,16.51 SV1.23
N$47
  Bottom 0.406: T18.C 39.05,16.51 42.86,20.32 46.99,20.32 SV1.22
N$48
  Bottom 0.406: T17.C 39.37,15.24 43.18,19.05 SV1.21
N$49
  Bottom 0.406: T16.C 39.37,11.43 41.27,13.34 41.27,15.24 43.81,17.78 46.99,17.78 SV1.24
N$50  (via drill 0.6 pad 1.42)
  Bottom 0.406: v108.58,22.86 104.14,22.86
N$51
  Bottom 0.406: R13.1 49.53,46.35 49.53,31.11 48.9,30.48 46.99,30.48 SV1.13
N$52  (via drill 0.6 pad 1.42)
  Top 0.406: v11.43,63.5 v11.43,30.48
  Bottom 0.406: IC1.9 v11.43,63.5 | v11.43,30.48 IC2.14
N$53  (via drill 0.6 pad 1.42)
  Top 0.406: v8.26,41.91 v8.26,11.43
  Bottom 0.406: IC3.14 6.99,10.16 v8.26,11.43 | IC2.9 7.62,43.18 8.26,42.55 v8.26,41.91
N$54  (via drill 0.6 pad 1.42)
  Top 0.406: v57.15,52.07 v57.15,68.58
  Bottom 0.406: IC3.9 10.48,22.86 11.11,22.23 11.11,14.61 10.48,13.97 3.49,13.97 1.59,15.88 1.59,66.04 4.13,68.58 v57.15,68.58 | IC4.14 56.52,50.8 57.15,51.44 v57.15,52.07
N$55  (via drill 2.2)
  other vias: 2.54,2.54
N$56
  Bottom 0.406: R35.2 84.45,53.34 T33.B
N$57
  Bottom 0.406: T12.C 38.73,62.23 40.64,60.33 40.64,57.78 42.86,55.56 42.86,53.02 44.77,51.12 44.77,48.58 46.35,46.99 46.35,46.35 SV1.2
N$58  (via drill 2.2)
  other vias: 146.69,2.54
N$59  (via drill 2.2)
  other vias: 146.69,67.31
N$60
  Bottom 0.406: T11.C 39.37,57.78 41.91,55.24 41.91,52.7 43.81,50.8 43.81,48.26 45.4,46.67 45.4,44.77 SV1.1
N$61
  Bottom 0.406: T10.C 38.73,57.15 40.96,54.93 40.96,52.39 42.86,50.48 42.86,47.94 44.45,46.35 44.45,43.81 45.09,43.18 46.99,43.18 SV1.4
N$62
  Bottom 0.406: R34.2 78.11,50.8 T32.B
N$63
  Bottom 0.406: R33.2 84.45,48.26 T31.B
N$64
  Bottom 0.406: R32.2 78.11,45.72 T30.B
N$65
  Bottom 0.406: R31.2 84.45,43.18 T29.B
N$66
  Bottom 0.406: R30.2 78.11,40.64 T28.B
N$67
  Bottom 0.406: R29.2 84.45,38.1 T27.B
N$68
  Bottom 0.406: R28.2 78.11,35.56 T26.B
N$69
  Bottom 0.406: R27.2 84.45,33.02 T25.B
N$70
  Bottom 0.406: T33.C 88.27,53.34 90.81,50.8 90.81,47.94 91.76,46.99 SV2.3
N$71
  Bottom 0.406: SV2.6 94.61,45.72 91.76,45.72 89.85,47.62 89.85,50.48 88.27,52.07 T32.C
N$72
  Bottom 0.406: T31.C 88.27,47.94 91.76,44.45 SV2.5
N$73
  Bottom 0.406: T26.C 89.53,36.83 90.81,38.1 94.61,38.1 SV2.12
N$74
  Bottom 0.406: T27.C SV2.9
N$75
  Bottom 0.406: R12.1 IC1.7
N$76
  Bottom 0.406: R11.1 IC1.6
N$77
  Bottom 0.406: R10.1 IC1.5
N$78
  Bottom 0.406: R9.1 IC1.4
N$79
  Bottom 0.406: R8.1 IC1.3
N$80
  Bottom 0.406: IC1.2 R7.1
N$81
  Bottom 0.406: R6.1 IC1.1
N$82
  Bottom 0.406: R5.1 17.14,43.18 15.88,44.45 12.7,44.45 12.06,45.09 12.06,46.99 10.79,48.26 IC1.15
N$83
  Bottom 0.406: T30.C 87.63,46.99 91.44,43.18 94.61,43.18 SV2.8
N$84
  Bottom 0.406: IC2.7 R4.1
N$85
  Bottom 0.406: IC2.6 R3.1
N$86
  Bottom 0.406: IC2.5 R2.1
N$87
  Bottom 0.406: IC2.4 R1.1
N$88
  Bottom 0.406: IC2.3 R25.1
N$89
  Bottom 0.406: IC2.2 R24.1
N$90
  Bottom 0.406: IC2.1 R23.1
N$91
  Bottom 0.406: R22.1 17.14,22.86 15.88,24.13 12.7,24.13 12.06,24.77 12.06,26.67 10.79,27.94 IC2.15
N$92
  Bottom 0.406: IC3.7 R21.1
N$93
  Bottom 0.406: IC3.6 R20.1
N$94
  Bottom 0.406: IC3.5 R19.1
N$95
  Bottom 0.406: IC3.4 R18.1
N$96
  Bottom 0.406: R17.1 IC3.3
N$97
  Bottom 0.406: IC3.2 R16.1
N$98
  Bottom 0.406: R15.1 IC3.1
N$99
  Bottom 0.406: R14.1 13.34,2.54 12.06,3.81 12.06,6.35 10.79,7.62 IC3.15
N$100
  Bottom 0.406: T29.C 88.27,43.81 90.17,41.91 SV2.7
N$101
  Bottom 0.406: SV2.10 94.61,40.64 89.53,40.64 88.27,41.91 T28.C
N$102
  Bottom 0.406: R51.2 78.11,30.48 T48.B
N$103
  Bottom 0.406: R50.2 84.45,27.94 T47.B
N$104
  Bottom 0.406: R49.2 78.11,25.4 T46.B
N$105
  Bottom 0.406: R48.2 84.45,22.86 T45.B
N$106
  Bottom 0.406: R47.2 78.11,20.32 T44.B
N$107
  Bottom 0.406: R46.2 84.45,17.78 T43.B
N$108
  Bottom 0.406: R45.2 78.11,15.24 T42.B
N$109
  Bottom 0.406: R44.2 84.45,12.7 T41.B
N$110
  Bottom 0.406: R43.2 78.11,10.16 T40.B
N$111
  Bottom 0.406: R42.2 84.45,7.62 T39.B
N$112
  Bottom 0.406: R41.2 78.11,5.08 T38.B
N$113
  Bottom 0.406: R40.2 84.45,2.54 T37.B
N$114
  Bottom 0.406: T48.C 88.27,31.75 89.53,33.02 94.61,33.02 SV2.16
N$115
  Bottom 0.406: T47.C 88.27,29.84 90.17,31.75 SV2.15
N$116
  Bottom 0.406: T46.C 88.27,26.67 92.08,30.48 94.61,30.48 SV2.18
N$117
  Bottom 0.406: T45.C 88.27,24.77 92.71,29.21 SV2.17
N$118
  Bottom 0.406: T44.C 88.27,21.59 SV2.19
N$119
  Bottom 0.406: T43.C SV2.21
N$120
  Bottom 0.406: T37.C 88.27,5.08 99.06,15.88 99.06,25.4 97.79,26.67 SV2.20
N$121
  Bottom 0.406: T38.C 87.63,6.35 98.11,16.83 98.11,23.18 97.16,24.13 SV2.22
N$122
  Bottom 0.406: T39.C 97.16,17.78 97.16,20.95 96.52,21.59 SV2.24
N$123
  Bottom 0.406: T42.C 88.27,16.51 SV2.23
N$124
  Bottom 0.406: T41.C SV2.25
N$125
  Bottom 0.406: T40.C 88.27,11.43 SV2.26
N$126
  Bottom 0.406: R38.1 IC4.7
N$127
  Bottom 0.406: IC4.6 R37.1
N$128
  Bottom 0.406: IC4.5 R36.1
N$129
  Bottom 0.406: R35.1 IC4.4
N$130
  Bottom 0.406: IC4.3 R34.1
N$131
  Bottom 0.406: R33.1 IC4.2
N$132
  Bottom 0.406: IC4.1 R32.1
N$133
  Bottom 0.406: IC4.15 59.69,48.26 60.96,46.99 60.96,45.09 61.59,44.45 65.41,44.45 R31.1
N$134
  Bottom 0.406: R30.1 IC5.7
N$135
  Bottom 0.406: IC5.6 R29.1
N$136
  Bottom 0.406: R28.1 IC5.5
N$137
  Bottom 0.406: IC5.4 R27.1
N$138
  Bottom 0.406: R51.1 IC5.3
N$139
  Bottom 0.406: IC5.2 R50.1
N$140
  Bottom 0.406: R49.1 IC5.1
N$141
  Bottom 0.406: R48.1 66.04,22.86 64.77,24.13 61.59,24.13 60.96,24.77 60.96,26.67 59.69,27.94 IC5.15
N$142
  Bottom 0.406: IC6.7 R47.1
N$143
  Bottom 0.406: R46.1 IC6.6
N$144
  Bottom 0.406: IC6.5 R45.1
N$145
  Bottom 0.406: R44.1 IC6.4
N$146
  Bottom 0.406: IC6.3 R43.1
N$147
  Bottom 0.406: R42.1 IC6.2
N$148
  Bottom 0.406: IC6.1 R41.1
N$149
  Bottom 0.406: IC6.15 60.33,7.62 60.96,6.99 60.96,4.45 61.59,3.81 65.41,3.81 R40.1
N$151  (via drill 0.6 pad 1.42)
  Top 0.406: v60.33,63.5 v60.33,30.48
  Bottom 0.406: IC4.9 v60.33,63.5 | v60.33,30.48 IC5.14
N$152  (via drill 0.6 pad 1.42)
  Top 0.406: v57.15,41.91 v57.15,11.43
  Bottom 0.406: IC5.9 56.52,43.18 57.15,42.55 v57.15,41.91 | IC6.14 56.52,10.16 57.15,10.79 v57.15,11.43
N$153  (via drill 0.6 pad 1.42)
  Top 0.406: v52.7,11.43 v52.7,1.91 | v101.6,39.37 v101.6,13.97
  Bottom 0.406: IC7.14 102.87,50.8 101.6,49.53 v101.6,39.37 | IC6.9 58.74,22.86 60.01,21.59 60.01,14.92 59.05,13.97 53.34,13.97 52.7,13.34 v52.7,11.43 | v101.6,13.97 99.06,13.97 90.17,5.08 90.17,2.54 88.9,1.27 53.34,1.27 v52.7,1.91
N$157
  Bottom 0.406: T25.C 90.81,34.29 SV2.11
N$158
  Bottom 0.406: R52.1 98.11,55.56 98.11,35.56 96.84,34.29 SV2.14
N$159
  Bottom 0.406: R39.1 97.16,53.98 97.16,36.2 96.52,35.56 94.61,35.56 SV2.13
N$160
  Bottom 0.406: T36.C 88.27,62.23 90.17,60.33 90.17,57.78 92.08,55.88 92.08,53.98 95.89,50.16 SV2.2
N$161
  Bottom 0.406: T35.C 88.27,58.42 91.12,55.56 91.12,53.34 93.34,51.12 SV2.1
N$162
  Bottom 0.406: SV2.4 94.61,48.26 92.08,48.26 91.76,48.58 91.76,51.12 90.17,52.7 90.17,55.24 88.27,57.15 T34.C
N$163
  Bottom 0.406: R64.2 127,60.96 T60.B
N$164
  Bottom 0.406: R63.2 133.35,58.42 T59.B
N$165
  Bottom 0.406: R62.2 127,55.88 T58.B
N$166
  Bottom 0.406: R61.2 133.35,53.34 T57.B
N$167
  Bottom 0.406: R60.2 127,50.8 T56.B
N$168
  Bottom 0.406: R59.2 133.35,48.26 T55.B
N$169
  Bottom 0.406: R58.2 127,45.72 T54.B
N$170
  Bottom 0.406: R57.2 133.35,43.18 T53.B
N$171
  Bottom 0.406: R56.2 127,40.64 T52.B
N$172
  Bottom 0.406: R55.2 133.35,38.1 T51.B
N$173
  Bottom 0.406: R54.2 127,35.56 T50.B
N$174
  Bottom 0.406: R53.2 133.35,33.02 T49.B
N$175
  Bottom 0.406: T57.C 137.16,53.34 139.7,50.8 139.7,47.94 140.65,46.99 SV3.3
N$176
  Bottom 0.406: T56.C 137.16,52.07 138.75,50.48 138.75,47.62 140.65,45.72 143.51,45.72 SV3.6
N$177
  Bottom 0.406: T55.C 137.16,47.94 140.65,44.45 SV3.5
N$178
  Bottom 0.406: T50.C 137.16,36.83 138.43,38.1 143.51,38.1 SV3.12
N$179
  Bottom 0.406: T51.C SV3.9
N$180
  Bottom 0.406: T54.C 136.53,46.99 140.34,43.18 143.51,43.18 SV3.8
N$181
  Bottom 0.406: T53.C 137.16,43.81 139.06,41.91 SV3.7
N$182
  Bottom 0.406: T52.C 137.16,41.91 138.43,40.64 143.51,40.64 SV3.10
N$183
  Bottom 0.406: R77.2 127,30.48 T72.B
N$184
  Bottom 0.406: R76.2 133.35,27.94 T71.B
N$185
  Bottom 0.406: R75.2 127,25.4 T70.B
N$186
  Bottom 0.406: R74.2 133.35,22.86 T69.B
N$187
  Bottom 0.406: R73.2 127,20.32 T68.B
N$188
  Bottom 0.406: R72.2 133.35,17.78 T67.B
N$189
  Bottom 0.406: R71.2 127,15.24 T66.B
N$190
  Bottom 0.406: R70.2 133.35,12.7 T65.B
N$191
  Bottom 0.406: R69.2 127,10.16 T64.B
N$192
  Bottom 0.406: R68.2 133.35,7.62 T63.B
N$193
  Bottom 0.406: R67.2 127,5.08 T62.B
N$194
  Bottom 0.406: R66.2 133.35,2.54 T61.B
N$195
  Bottom 0.406: T72.C 137.79,31.75 139.06,33.02 143.51,33.02 SV3.16
N$196
  Bottom 0.406: T71.C 139.7,31.75 SV3.15
N$197
  Bottom 0.406: T70.C 136.53,26.67 140.34,30.48 143.51,30.48 SV3.18
N$198
  Bottom 0.406: T69.C 137.16,25.4 140.97,29.21 SV3.17
N$199
  Bottom 0.406: T68.C 137.16,21.59 SV3.19
N$200
  Bottom 0.406: T67.C SV3.21
N$201
  Bottom 0.406: T61.C 137.16,5.08 147.96,15.88 147.96,25.4 146.69,26.67 SV3.20
N$202
  Bottom 0.406: T62.C 136.53,6.35 147,16.83 147,23.18 146.05,24.13 SV3.22
N$203
  Bottom 0.406: T63.C 146.05,17.78 146.05,20.32 SV3.24
N$204
  Bottom 0.406: T66.C 137.16,16.51 SV3.23
N$205
  Bottom 0.406: T65.C SV3.25
N$206
  Bottom 0.406: T64.C 137.16,11.43 SV3.26
N$207
  Bottom 0.406: R64.1 IC7.7
N$208
  Bottom 0.406: IC7.6 R63.1
N$209
  Bottom 0.406: R62.1 IC7.5
N$210
  Bottom 0.406: IC7.4 R61.1
N$211
  Bottom 0.406: R60.1 IC7.3
N$212
  Bottom 0.406: IC7.2 R59.1
N$213
  Bottom 0.406: R58.1 IC7.1
N$214
  Bottom 0.406: IC7.15 108.58,48.26 109.86,46.99 109.86,45.09 110.49,44.45 114.3,44.45 R57.1
N$215
  Bottom 0.406: IC8.7 R56.1
N$216
  Bottom 0.406: R55.1 IC8.6
N$217
  Bottom 0.406: IC8.5 R54.1
N$218
  Bottom 0.406: R53.1 IC8.4
N$219
  Bottom 0.406: IC8.3 R77.1
N$220
  Bottom 0.406: R76.1 IC8.2
N$221
  Bottom 0.406: IC8.1 R75.1
N$222
  Bottom 0.406: IC8.15 108.58,27.94 109.86,26.67 109.86,24.77 110.49,24.13 114.3,24.13 R74.1
N$223
  Bottom 0.406: IC9.7 R73.1
N$224
  Bottom 0.406: R72.1 IC9.6
N$225
  Bottom 0.406: IC9.5 R71.1
N$226
  Bottom 0.406: R70.1 IC9.4
N$227
  Bottom 0.406: IC9.3 R69.1
N$228
  Bottom 0.406: R68.1 IC9.2
N$229
  Bottom 0.406: IC9.1 R67.1
N$230
  Bottom 0.406: IC9.15 109.22,7.62 109.86,6.99 109.86,4.45 110.49,3.81 114.3,3.81 R66.1
N$232  (via drill 0.6 pad 1.42)
  Top 0.406: v109.22,30.48 v109.22,63.5
  Bottom 0.406: IC7.9 v109.22,63.5 | IC8.14 v109.22,30.48
N$233  (via drill 0.6 pad 1.42)
  Top 0.406: v106.05,41.91 v106.05,8.89
  Bottom 0.406: IC8.9 105.41,43.18 106.05,42.55 v106.05,41.91 | IC9.14 105.41,10.16 106.05,9.53 v106.05,8.89
N$238
  Bottom 0.406: T49.C 139.7,36.83 SV3.11
N$239
  Bottom 0.406: R78.1 146.05,53.02 147,52.07 147,35.56 145.73,34.29 SV3.14
N$240
  Bottom 0.406: R65.1 146.05,51.44 146.05,36.2 145.41,35.56 143.51,35.56 SV3.13
N$241
  Bottom 0.406: T60.C 137.16,62.23 139.06,60.33 139.06,57.78 140.97,55.88 140.97,53.98 144.78,50.16 SV3.2
N$242
  Bottom 0.406: T59.C 137.16,58.42 140.02,55.56 140.02,53.34 142.24,51.12 SV3.1
N$243
  Bottom 0.406: T58.C 137.16,57.15 139.06,55.24 139.06,52.7 140.65,51.12 140.65,48.58 140.97,48.26 143.51,48.26 SV3.4
RCK  (via drill 0.6 pad 1.42)
  Top 0.406: v48.9,65.09 v54.29,65.09
  Bottom 0.406: 48.9,64.77 4.45,64.77 2.54,62.87 2.54,55.88 | 51.44,55.88 51.44,57.78 50.16,59.05 50.16,63.5 48.9,64.77 | 51.44,55.88 51.44,35.56 | 51.44,35.56 51.44,29.21 50.16,27.94 50.16,15.24 | 50.16,15.24 IC6.12 | IC4.12 51.44,55.88 | IC5.12 51.44,35.56 | 3.81,55.88 IC1.12 2.54,55.88 | 2.54,55.88 2.54,35.56 | 2.54,35.56 2.54,16.51 3.81,15.24 IC3.12 | 50.16,15.24 50.16,12.06 46.99,8.89 J1.2 | IC7.12 99.06,55.88 | 99.06,55.88 99.06,56.83 98.42,57.47 94.93,57.47 87.63,64.77 54.61,64.77 v54.29,65.09 | IC8.12 99.06,35.56 | 99.06,35.56 99.06,55.88 | IC9.12 101.6,15.24 100.33,16.51 100.33,26.67 99.06,27.94 99.06,35.56 | IC2.12 2.54,35.56 | v48.9,65.09 48.9,64.77
SCK  (via drill 0.6 pad 1.42)
  Top 0.406: v3.81,66.04 v3.81,59.69 | v51.44,16.51 v51.44,13.97 | v51.44,66.04 v56.2,66.04
  Bottom 0.406: v3.81,66.04 36.83,66.04 37.47,65.41 44.45,65.41 45.72,66.67 50.8,66.67 v51.44,66.04 51.44,60.33 53.34,58.42 IC4.11 56.52,58.42 57.15,57.78 57.15,55.24 56.52,54.61 53.34,54.61 52.39,53.66 52.39,39.05 53.34,38.1 IC5.11 56.52,38.1 57.15,37.47 57.15,34.92 56.52,34.29 53.34,34.29 52.39,33.34 52.39,27.94 51.44,26.67 51.44,17.78 | IC6.11 51.44,17.78 | IC3.11 4.45,17.78 3.49,18.73 3.49,33.34 4.45,34.29 7.62,34.29 8.26,34.92 8.26,37.47 7.62,38.1 IC2.11 4.45,38.1 3.49,39.05 3.49,53.66 4.45,54.61 7.62,54.61 8.26,55.24 8.26,57.15 6.99,58.42 IC1.11 4.45,58.42 3.81,59.05 v3.81,59.69 | 51.44,17.78 v51.44,16.51 | v56.2,66.04 88.27,66.04 95.89,58.42 IC7.11 105.41,58.42 106.05,57.78 106.05,55.24 105.41,54.61 100.97,54.61 100.01,53.66 100.01,39.05 100.97,38.1 IC8.11 105.41,38.1 106.05,37.47 106.05,34.92 105.41,34.29 102.23,34.29 101.28,33.34 101.28,18.73 102.23,17.78 IC9.11 | v51.44,13.97 51.44,11.43 49.53,9.53 J1.1
SER  (via drill 0.6 pad 1.42)
  Top 0.406: v41.91,3.17 41.91,-1.27 1.59,-1.27 1.59,49.53 v8.26,49.53
  Bottom 0.406: v41.91,3.17 43.18,4.45 J1.3 | IC1.14 7.62,50.8 8.26,50.16 v8.26,49.53
VCC  (via drill 0.6 pad 1.42)
  Top 0.406: v9.84,55.24 v9.84,46.35 | v9.84,34.92 v9.84,25.4 | v9.84,5.08 v9.84,20.32 | v58.74,55.24 v58.74,46.99 | v58.74,20.32 v58.74,5.08 | v58.74,25.4 v58.74,34.92 | v9.84,67.31 v9.84,62.23 | v40.64,67.31 v40.64,62.55 | v107.63,46.99 v107.63,55.24 | v107.63,34.92 v107.63,25.4 | v107.63,5.08 v107.63,20.32
  Bottom 0.406: v9.84,25.4 IC2.16 5.08,25.4 4.45,24.77 4.45,20.95 5.08,20.32 IC3.10 v9.84,20.32 | IC3.16 v9.84,5.08 | IC6.10 v58.74,20.32 53.98,20.32 53.34,20.95 53.34,24.77 53.98,25.4 IC5.16 v58.74,25.4 | 53.02,67.31 53.02,61.91 53.98,60.96 IC4.10 57.47,60.96 58.74,59.69 v58.74,55.24 | v9.84,67.31 v40.64,67.31 53.02,67.31 | IC1.10 9.84,60.96 | 9.84,60.96 v9.84,62.23 | v9.84,55.24 9.84,60.96 | v58.74,5.08 IC6.16 | v9.84,46.35 9.84,45.72 | 9.84,45.72 9.84,40.64 | 9.84,40.64 v9.84,34.92 | IC1.16 9.84,45.72 | IC2.10 9.84,40.64 | v58.74,46.99 58.74,45.72 | 58.74,45.72 58.74,40.64 | 58.74,40.64 v58.74,34.92 | IC4.16 58.74,45.72 | IC5.10 58.74,40.64 | v40.64,62.55 42.23,60.96 J2.3 | 53.02,67.31 88.9,67.31 95.25,60.96 IC7.10 106.36,60.96 107.63,59.69 v107.63,55.24 | IC7.16 107.63,45.72 | 107.63,45.72 107.63,40.64 | IC8.10 107.63,40.64 | 107.63,40.64 v107.63,34.92 | v107.63,46.99 107.63,45.72 | v107.63,25.4 IC8.16 102.87,25.4 102.23,24.77 102.23,20.95 102.87,20.32 IC9.10 v107.63,20.32 | IC9.16 v107.63,5.08

### Text on the board
Bottom: v7 | KJ-3